# Altium schematic sheet STRWHL-S06-V00-Connectors.SchDoc
size A3
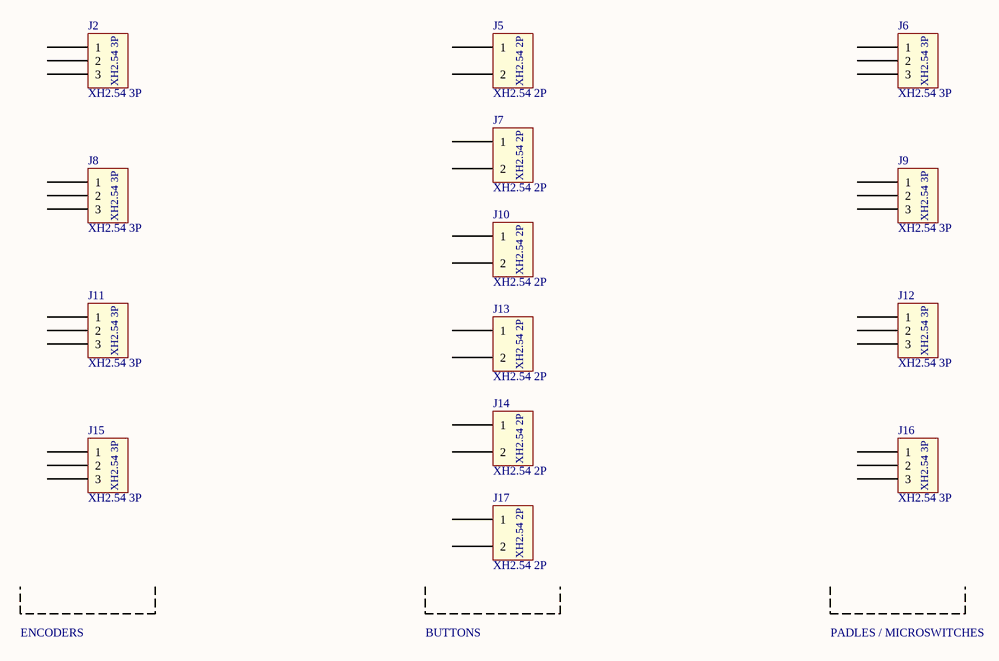
[diagram p0: STRWHL-S06-V00-Connectors.SchDoc]

## Parts
J2  XH2.54 3P  [JST_XH254_3P_TH_RH]
J5  XH2.54 2P  [JST_XH254_2P_TH_RH]
J6  XH2.54 3P  [JST_XH254_3P_TH_RH]
J7  XH2.54 2P  [JST_XH254_2P_TH_RH]
J8  XH2.54 3P  [JST_XH254_3P_TH_RH]
J9  XH2.54 3P  [JST_XH254_3P_TH_RH]
J10  XH2.54 2P  [JST_XH254_2P_TH_RH]
J11  XH2.54 3P  [JST_XH254_3P_TH_RH]
J12  XH2.54 3P  [JST_XH254_3P_TH_RH]
J13  XH2.54 2P  [JST_XH254_2P_TH_RH]
J14  XH2.54 2P  [JST_XH254_2P_TH_RH]
J15  XH2.54 3P  [JST_XH254_3P_TH_RH]
J16  XH2.54 3P  [JST_XH254_3P_TH_RH]
J17  XH2.54 2P  [JST_XH254_2P_TH_RH]

## Nets

Not connected (* = marked no-connect by the designer): J2 1 2 3; J5 1 2; J6 1 2 3; J7 1 2; J8 1 2 3; J9 1 2 3; J10 1 2; J11 1 2 3; J12 1 2 3; J13 1 2; J14 1 2; J15 1 2 3; J16 1 2 3; J17 1 2

## Notes on the sheet
- ENCODERS
- BUTTONS
- PADLES / MICROSWITCHES
- Revision History:
- Sheet Title:
- Rev
- Date
- Description
- Project:
- Size:
- Drawn By:
- A3
- Number:
- Revision:
- Sheet
- Version:
- of
- QUT Motorsport
- O-120, Gardens Point
- 2 George Street
- Brisbane, QLD 4000
- Australia
- Print Date:
- Print Time:
- File Name: